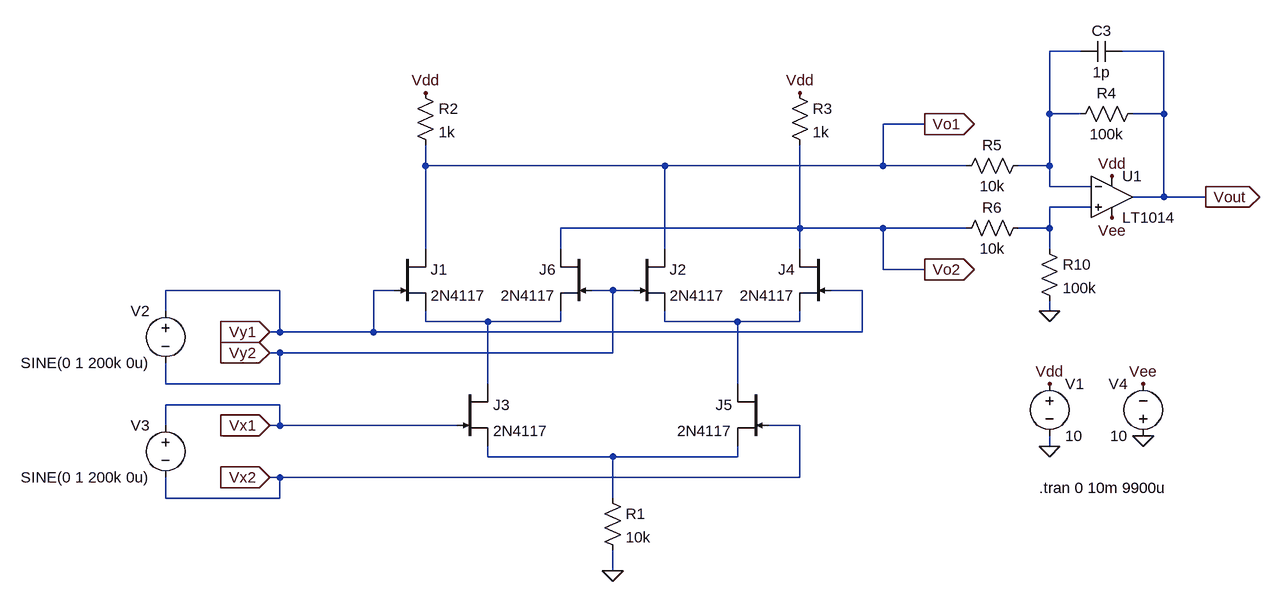
[diagram p0: schematic Balanced Mixer Phase Detector-Gilbert Cell.asc]
Balanced Mixer Phase Detector-Gilbert Cell.asc, the LTspice schematic file:
Version 4
SHEET 1 1616 680
WIRE 976 -352 928 -352
WIRE 1104 -352 1040 -352
WIRE 928 -256 928 -352
WIRE 976 -256 928 -256
WIRE 1104 -256 1104 -352
WIRE 1104 -256 1056 -256
WIRE 736 -240 672 -240
WIRE -32 -176 -32 -208
WIRE 336 -176 -32 -176
WIRE 672 -176 672 -240
WIRE 672 -176 336 -176
WIRE 800 -176 672 -176
WIRE 928 -176 928 -256
WIRE 928 -176 880 -176
WIRE 928 -144 928 -176
WIRE 992 -144 928 -144
WIRE 1104 -128 1104 -256
WIRE 1104 -128 1056 -128
WIRE 1168 -128 1104 -128
WIRE 992 -112 928 -112
WIRE 544 -80 544 -208
WIRE 544 -80 176 -80
WIRE 672 -80 544 -80
WIRE 800 -80 672 -80
WIRE 928 -80 928 -112
WIRE 928 -80 880 -80
WIRE -32 -48 -32 -176
WIRE 176 -48 176 -80
WIRE 336 -48 336 -176
WIRE 544 -48 544 -80
WIRE 928 -48 928 -80
WIRE 672 -16 672 -80
WIRE 736 -16 672 -16
WIRE -256 16 -432 16
WIRE -80 16 -112 16
WIRE 256 16 224 16
WIRE 288 16 256 16
WIRE 640 16 592 16
WIRE -432 48 -432 16
WIRE 928 48 928 32
WIRE -32 64 -32 48
WIRE 64 64 -32 64
WIRE 176 64 176 48
WIRE 176 64 64 64
WIRE 336 64 336 48
WIRE 448 64 336 64
WIRE 544 64 544 48
WIRE 544 64 448 64
WIRE -256 80 -256 16
WIRE -256 80 -272 80
WIRE -112 80 -112 16
WIRE -112 80 -256 80
WIRE 640 80 640 16
WIRE 640 80 -112 80
WIRE -256 112 -272 112
WIRE 256 112 256 16
WIRE 256 112 -256 112
WIRE -432 160 -432 128
WIRE -256 160 -256 112
WIRE -256 160 -432 160
WIRE 64 160 64 64
WIRE 448 160 448 64
WIRE -256 192 -432 192
WIRE -432 224 -432 192
WIRE -256 224 -256 192
WIRE -256 224 -272 224
WIRE 16 224 -256 224
WIRE 544 224 496 224
WIRE 928 256 928 240
WIRE 64 272 64 256
WIRE 256 272 64 272
WIRE 448 272 448 256
WIRE 448 272 256 272
WIRE -256 304 -272 304
WIRE 544 304 544 224
WIRE 544 304 -256 304
WIRE -432 336 -432 304
WIRE -256 336 -256 304
WIRE -256 336 -432 336
WIRE 256 336 256 272
WIRE 256 448 256 416
FLAG -272 80 Vy1
IOPIN -272 80 In
FLAG -272 112 Vy2
IOPIN -272 112 In
FLAG -32 -288 Vdd
FLAG 544 -288 Vdd
FLAG 256 448 0
FLAG -272 224 Vx1
IOPIN -272 224 In
FLAG -272 304 Vx2
IOPIN -272 304 In
FLAG 736 -240 Vo1
IOPIN 736 -240 Out
FLAG 736 -16 Vo2
IOPIN 736 -16 Out
FLAG 928 256 0
FLAG 928 160 Vdd
FLAG 1024 -160 Vdd
FLAG 1168 -128 Vout
IOPIN 1168 -128 Out
FLAG 928 48 0
FLAG 1072 240 0
FLAG 1072 160 Vee
FLAG 1024 -96 Vee
SYMBOL njf -80 -48 R0
SYMATTR InstName J1
SYMATTR Value 2N4117
SYMBOL njf 288 -48 R0
SYMATTR InstName J2
SYMATTR Value 2N4117
SYMBOL njf 16 160 R0
SYMATTR InstName J3
SYMATTR Value 2N4117
SYMBOL njf 592 -48 M0
SYMATTR InstName J4
SYMATTR Value 2N4117
SYMBOL njf 496 160 M0
SYMATTR InstName J5
SYMATTR Value 2N4117
SYMBOL njf 224 -48 M0
SYMATTR InstName J6
SYMATTR Value 2N4117
SYMBOL res 240 320 R0
SYMATTR InstName R1
SYMATTR Value 10k
SYMBOL res -48 -304 R0
SYMATTR InstName R2
SYMATTR Value 1k
SYMBOL res 528 -304 R0
SYMATTR InstName R3
SYMATTR Value 1k
SYMBOL voltage 928 144 R0
WINDOW 123 0 0 Left 0
WINDOW 39 0 0 Left 0
SYMATTR InstName V1
SYMATTR Value 10
SYMBOL voltage -432 32 M0
WINDOW 123 0 0 Left 0
WINDOW 39 0 0 Left 0
SYMATTR InstName V2
SYMATTR Value SINE(0 1 200k 0u)
SYMBOL voltage -432 208 M0
WINDOW 123 0 0 Left 0
WINDOW 39 0 0 Left 0
SYMATTR InstName V3
SYMATTR Value SINE(0 1 200k 0u)
SYMBOL Opamps\\LT1014 1024 -192 R0
SYMATTR InstName U1
SYMBOL res 1072 -272 R90
WINDOW 0 0 56 VBottom 2
WINDOW 3 32 56 VTop 2
SYMATTR InstName R4
SYMATTR Value 100k
SYMBOL res 896 -192 R90
WINDOW 0 0 56 VBottom 2
WINDOW 3 32 56 VTop 2
SYMATTR InstName R5
SYMATTR Value 10k
SYMBOL res 896 -96 R90
WINDOW 0 0 56 VBottom 2
WINDOW 3 32 56 VTop 2
SYMATTR InstName R6
SYMATTR Value 10k
SYMBOL res 912 -64 R0
SYMATTR InstName R10
SYMATTR Value 100k
SYMBOL voltage 1072 256 R180
WINDOW 0 24 96 Left 2
WINDOW 3 24 16 Left 2
WINDOW 123 0 0 Left 0
WINDOW 39 0 0 Left 0
SYMATTR InstName V4
SYMATTR Value 10
SYMBOL cap 1040 -368 R90
WINDOW 0 0 32 VBottom 2
WINDOW 3 32 32 VTop 2
SYMATTR InstName C3
SYMATTR Value 1p
TEXT 912 320 Left 2 !.tran 0 10m 9900u

The netlist it stands for:
* Balanced Mixer Phase Detector-Gilbert Cell.asc
J1 Vo1 Vy1 N003 2N4117
J2 Vo1 Vy2 N004 2N4117
J3 N003 Vx1 N005 2N4117
J4 Vo2 Vy1 N004 2N4117
J5 N004 Vx2 N005 2N4117
J6 Vo2 Vy2 N003 2N4117
R1 N005 0 10k
R2 Vdd Vo1 1k
R3 Vdd Vo2 1k
V1 Vdd 0 10
V2 Vy1 Vy2 SINE(0 1 200k 0u)
V3 Vx1 Vx2 SINE(0 1 200k 0u)
XU1 N002 N001 Vdd Vee Vout LT1014  ; pins In+ In- V+ V- OUT
R4 Vout N001 100k
R5 N001 Vo1 10k
R6 N002 Vo2 10k
R10 N002 0 100k
V4 0 Vee 10
C3 Vout N001 1p
.model NJF NJF
.model PJF PJF
.lib standard.jft
.tran 0 10m 9900u
.backanno
.end